# EAGLE design mainboard (EAGLE 6.4)
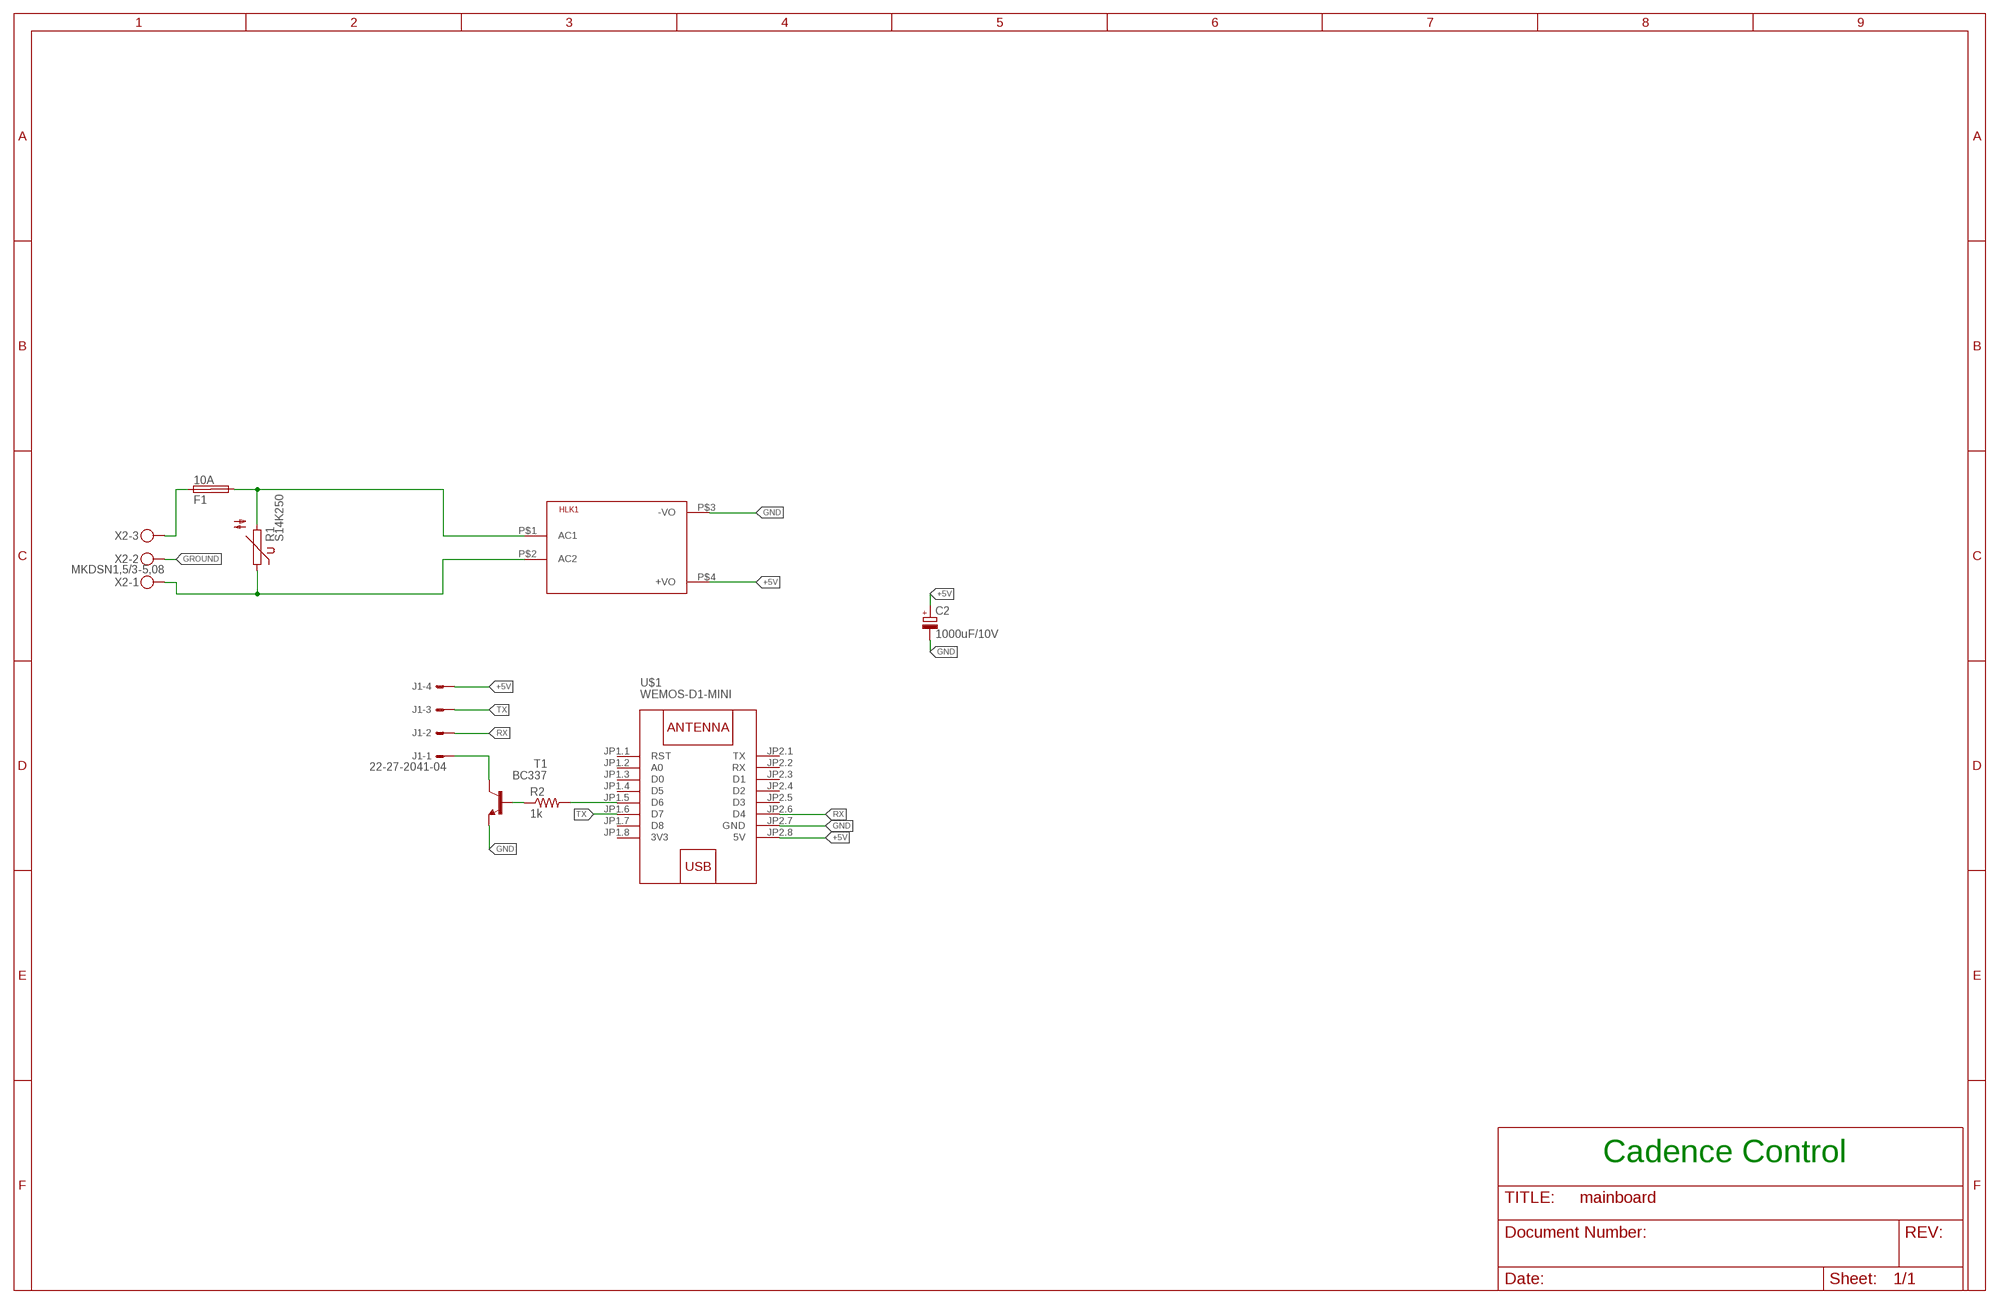
[diagram p0: schematic, sheet 1]

## Parts
C2  1000uF/10V  CPOL-EUE3.5-8  [E3,5-8]
F1  10A  SHK20L  [SHK20L]
HLK1  HLK-PM013W  [HLK-PM01]
J1  22-27-2041-04  [6410-04]
R1  S14K250  [S14K250]
R2  1k  R-US_0207/10  [0207/10]
T1  BC337  [TO92]
U$1  WEMOS-D1-MINI  [WEMOS-D1-MINI]
X2  MKDSN1,5/3-5,08  [MKDSN1,5/3-5,08]

## Nets
+5V: C2.+ HLK1.P$4(+VO) J1.4 U$1.JP2.8(5V)
GND: C2.- HLK1.P$3(-VO) T1.1(E) U$1.JP2.7(GND)
GROUND: X2.2
LCD_GND: J1.1 T1.3(C)
N$1: R2.2 U$1.JP1.5(D6)
N$2: R2.1 T1.2(B)
N$13: HLK1.P$2(AC2) R1.1 X2.1
N$16: F1.2A HLK1.P$1(AC1) R1.2
N$23: F1.1A X2.3
RX: J1.2 U$1.JP2.6(D4)
TX: J1.3 U$1.JP1.6(D7)
Unconnected: F1.1B F1.2B U$1.JP1.1(RST) U$1.JP1.2(A0) U$1.JP1.3(D0) U$1.JP1.4(D5) U$1.JP1.7(D8) U$1.JP2.1(TX) U$1.JP2.2(RX) U$1.JP2.3(D1) U$1.JP2.4(D2) U$1.JP2.5(D3)

## Notes on the sheet
- Cadence Control

## Power pins joined to a net without a drawn wire
3V3: U$1.JP1.8(3V3)

## Library data of the parts
C2 = rcl:CPOL-EU: POLARIZED CAPACITOR, European symbol
F1 = fuse:SHK20L: FUSE HOLDER 5 x 20 mm, SH contact, SHH1 Schukat, E1073 Buerklin; OC_FARNELL: unknown; OC_NEWARK: unknown
HLK1 = HLK-PM01:HLK-PM01: Hi-Link Power Supply HLK-PM01 3W Author: Ahmed Said <https://github.com/AhmedSaid/EAGLELibraries>
J1 = con-molex:22-?-04: CONNECTOR wire to board 2.54 mm (.1 inch) pitch header; OC_FARNELL: unknown; OC_NEWARK: unknown
R1 = varistor:S14K250: VARISTOR
R2 = adafruit:R-US_: RESISTOR, American symbol
T1 = transistor-neu-to92:BC337: NPN TRANSISTOR
U$1 = diy-modules:WEMOS-D1-MINI: WEMOS D1 mini: Mini Wi-Fi Board based on ESP-8266 device More details can be found here: https://www.wemos.cc/product/d1-mini.html Click here to find device on ebay.com <http://www.ebay.com/sch/wemos+d1+mini+nodemcu>
X2 = con-phoenix-508:MKDSN1,5/3-5,08: MKDSN 1,5/ 3-5,08 Printklemme Nennstrom: 13,5 A Nennspannung: 250 V Rastermaß: 5,08 mm Polzahl: 3 Anschlussart: Schraubanschluss Montage: Löten Anschlussrichtung Leiter/Platine: 0 ° Artikelnummer: 1729131 Source: http://eshop.phoenixcontact.com .. 1729131.pdf; MPN: SMKDSN1,5/3-5,08; OC_FARNELL: 1792904; OC_NEWARK: 70R0299

## Board
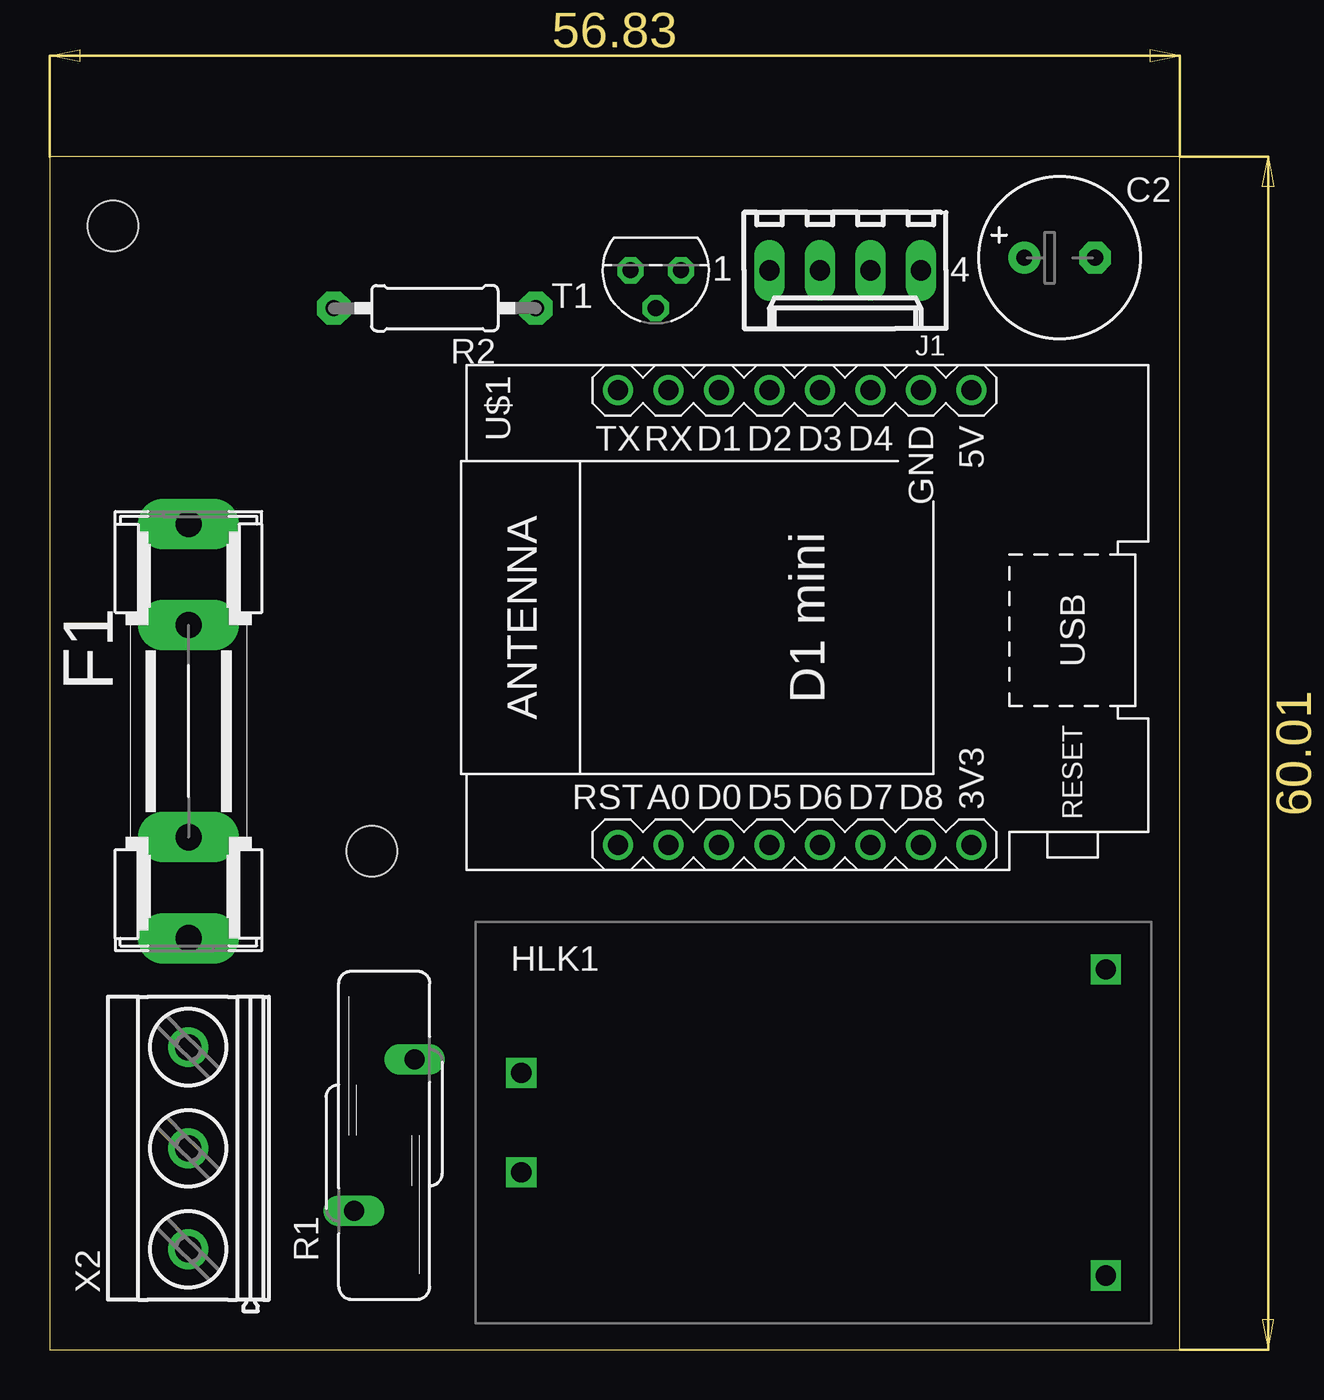
[diagram p1: board, top side]
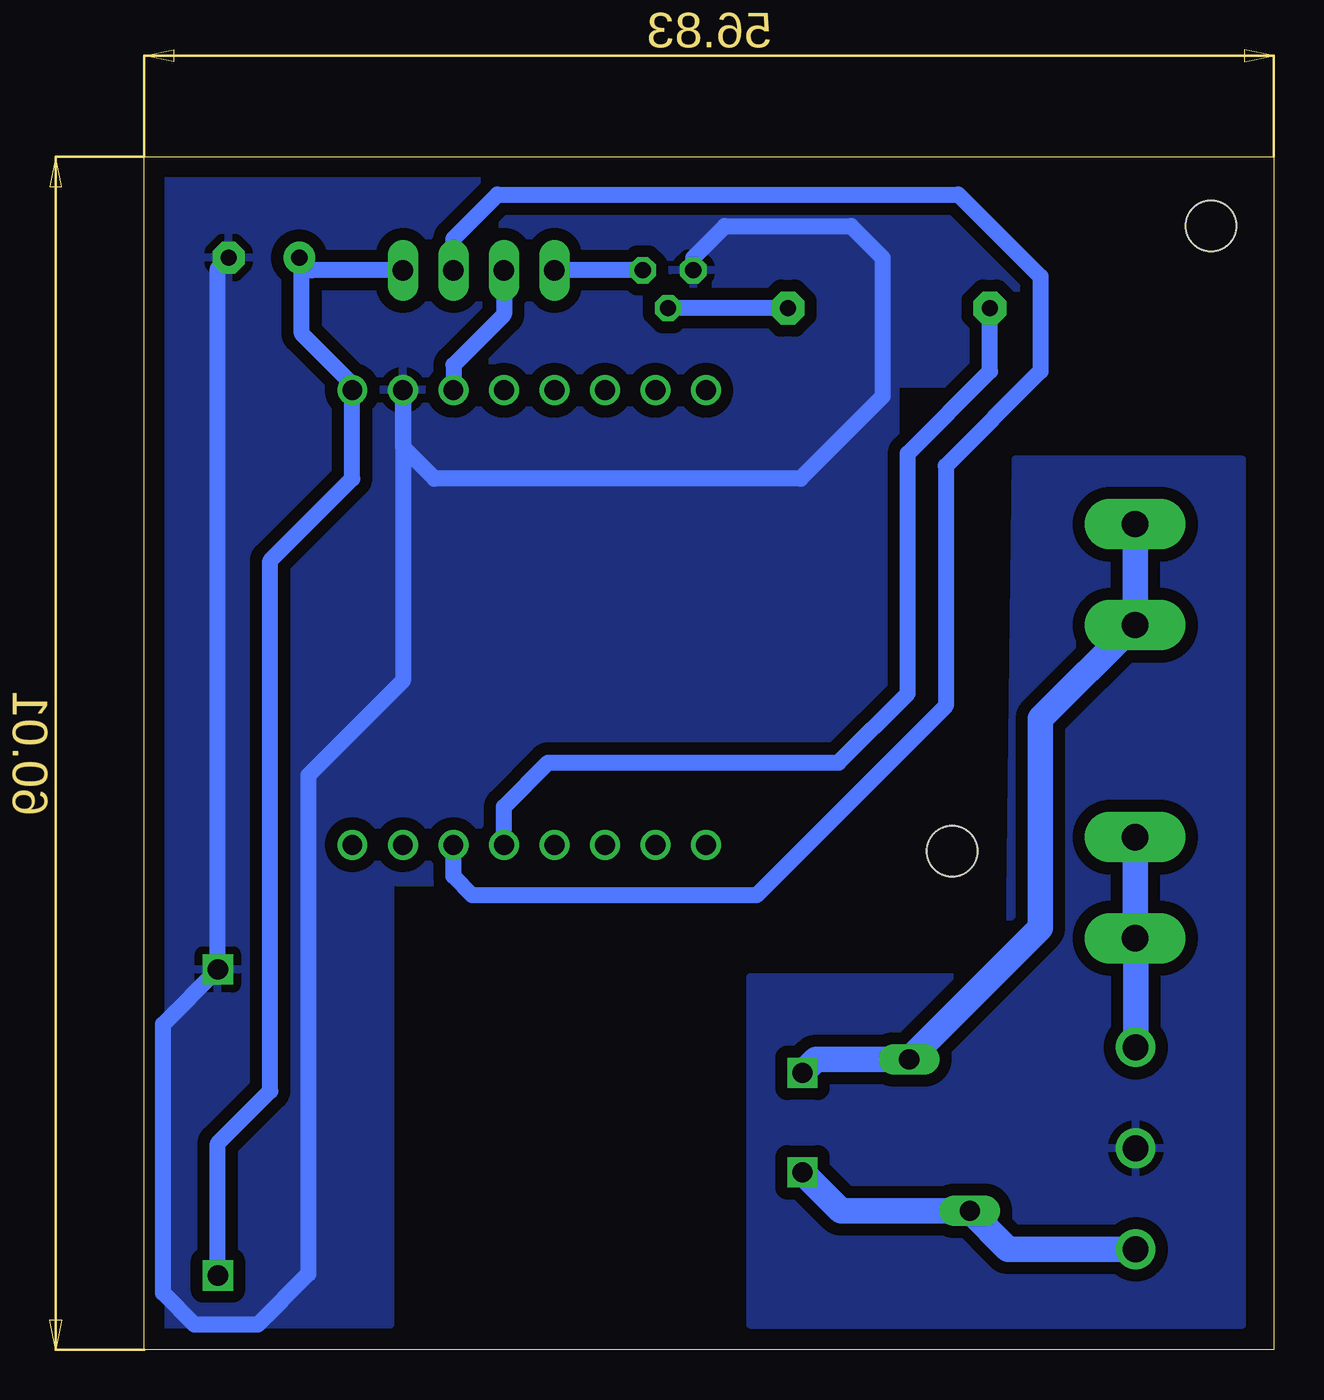
[diagram p2: board, bottom side, seen from below]

Size 56.83 x 60.01 mm. Coordinates in mm from the lower left corner, seen from the top.
Outline: 0,0 56.83,0 56.83,60.01 0,60.01 0,0
Copper layers (1*16): Top 0.035mm / dielectric 1.5mm / Bottom 0.035mm
Design rules "default *": minimum track width 16mil, minimum drill 24mil, track to track 24mil, track to pad 24mil, pad to pad 24mil, via to via 24mil, smd to smd 24mil, copper to edge 40mil, drill to drill 8mil, minimum pad ring 10mil, minimum via ring 8mil, stop-mask expansion 4mil, vias tented up to drill 0mil, thermal gap 16mil
Holes 2.54 mm at 3.17,56.52 16.19,25.08

### Footprints (pad centres in the part's own frame; a part is rotated, then mirrored left to right if it is on the bottom)
E3,5-8 = drill 0.813 pad 1.6: + -1.778,0 | drill 0.813 pad 1.6 octagon: - 1.778,0
SHK20L = drill 1.321 pad 2.54 long: 1A -10.414,0; 1B -5.334,0; 2A 10.414,0; 2B 5.334,0
HLK-PM01 = drill 1.016 square: P$1 -14.7,2.5; P$2 -14.7,-2.5; P$3 14.7,7.7; P$4 14.7,-7.7
6410-04 = drill 1.016 long: 1 3.81,0; 2 1.27,0; 3 -1.27,0; 4 -3.81,0
S14K250 = drill 1.016 long: 1 -1.524,-3.81; 2 1.524,3.81
0207/10 = drill 0.813 pad 1.676 octagon: 1 -5.08,0; 2 5.08,0
TO92 = drill 0.813 octagon: 1 1.27,0; 2 0,1.905; 3 -1.27,0
WEMOS-D1-MINI = drill 1: JP1.1 -11.43,9.525; JP1.2 -11.43,6.985; JP1.3 -11.43,4.445; JP1.4 -11.43,1.905; JP1.5 -11.43,-0.635; JP1.6 -11.43,-3.175; JP1.7 -11.43,-5.715; JP1.8 -11.43,-8.255; JP2.1 11.43,9.525; JP2.2 11.43,6.985; JP2.3 11.43,4.445; JP2.4 11.43,1.905; JP2.5 11.43,-0.635; JP2.6 11.43,-3.175; JP2.7 11.43,-5.715; JP2.8 11.43,-8.255
MKDSN1,5/3-5,08 = drill 1.3 pad 2: 1 -7.641,0.025; 2 -2.561,0.025; 3 2.519,0.025

### Placement (x,y rotation side)
C2  50.8,54.93 0 top
F1  6.99,31.11 90 top
HLK1  38.42,11.43 0 top
J1  40.01,54.29 180 top
R1  16.83,10.79 0 top
R2  19.37,52.39 180 top
T1  30.48,54.29 180 top
U$1  38.1,36.83 90 top
X2  6.99,12.7 90 top

### Tracks (layer width: path | path; a pad name or v marks a point on that pad's centre or on a via)
+5V
  Bottom 0.813: J1.4 48.39,54.29 C2.+ 48.9,54.8 48.9,51.12 46.35,48.58 U$1.JP2.8 46.35,43.81 50.48,39.69 50.48,13.02 53.12,10.38 HLK1.P$4
GND
  Bottom 0.813: T1.1 29.21,54.93 27.62,56.52 21.27,56.52 19.68,54.93 19.68,47.94 23.81,43.81 42.23,43.81 43.81,45.4 U$1.JP2.7 43.81,33.66 48.58,28.89 48.58,3.81 51.12,1.27 54.29,1.27 55.88,2.86 55.88,16.37 HLK1.P$3 53.12,54.39 C2.-
  pour Bottom: 19.05,23.5 44.45,23.5 44.45,1.27 56.2,1.27 55.88,59.37 11.11,59.37 11.11,48.58 19.05,48.58
GROUND
  pour Bottom: 26.35,18.73 26.35,1.27 1.59,1.27 1.59,44.77 13.02,44.77 13.34,18.73
LCD_GND
  Bottom 0.813: T1.3 J1.1
N$1
  Bottom 0.813: U$1.JP1.5 38.73,27.3 36.51,29.53 21.91,29.53 18.41,33.02 18.41,45.09 14.29,49.21 R2.2
N$2
  Bottom 0.813: R2.1 T1.2
N$3
  Bottom 1.27: 6.99,20.64 6.99,25.72
N$13
  Bottom 1.27: X2.1 13.38,5.06 R1.1 21.77,6.99 HLK1.P$2
N$16
  Bottom 1.27: HLK1.P$1 23.04,14.61 R1.2 11.75,21.21 11.75,31.75 6.99,36.51 F1.2A
N$23
  Bottom 1.27: X2.3 6.96,20.68 F1.1A
RX
  Bottom 0.813: J1.2 38.73,52.07 41.27,49.53 U$1.JP2.6
TX
  Bottom 0.813: J1.3 41.27,55.88 39.05,58.1 15.88,58.1 11.75,53.98 11.75,49.21 16.51,44.45 16.51,32.38 26.04,22.86 40.32,22.86 41.27,23.81 U$1.JP1.6